# EAGLE design spi2par2019backpack (EAGLE 9.3.0)
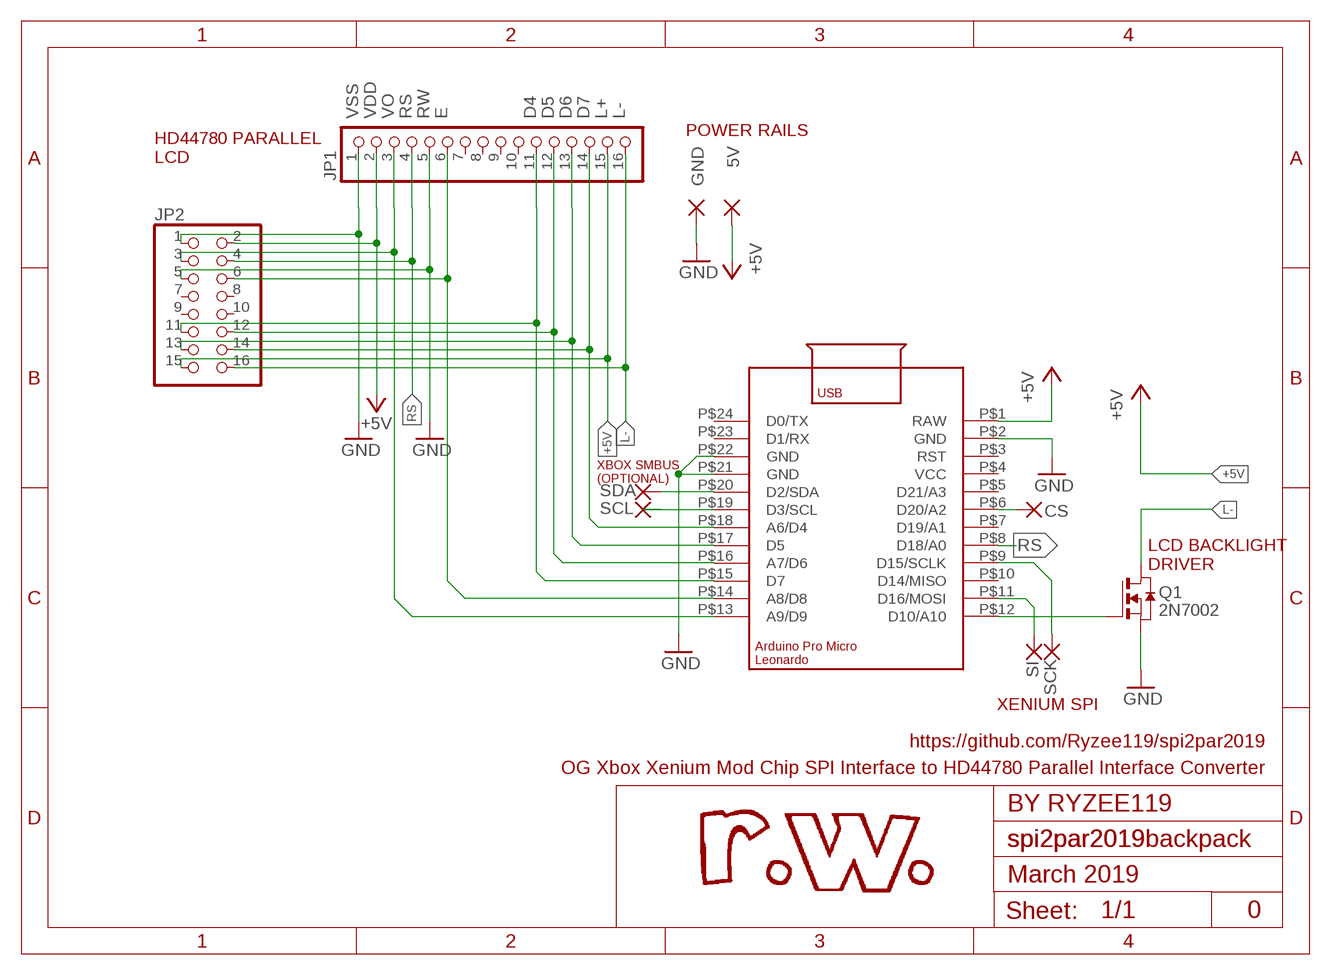
[diagram p0: schematic, sheet 1]

## Parts
5V  WIREPADSMD1,27-254  [SMD1,27-2,54]
CS  WIREPADSMD1,27-254  [SMD1,27-2,54]
GND  WIREPADSMD1,27-254  [SMD1,27-2,54]
JP1  PINHD-1X16  [1X16]
JP2  PINHD-2X8  [2X08]
Q1  2N70026Ω  NMOSSOT23  [SOT-23]
SCK  WIREPADSMD1,27-254  [SMD1,27-2,54]
SCL  WIREPADSMD1,27-254  [SMD1,27-2,54]
SDA  WIREPADSMD1,27-254  [SMD1,27-2,54]
SI  WIREPADSMD1,27-254  [SMD1,27-2,54]
U1  ARDUINO_LEONARDO_MICRO  [ARDUINO_LEONARDO_MICRO]

## Nets
+5V: 5V.1(P) JP1.2 JP1.15 JP2.2 JP2.15 U1.P$1(RAW)
D4: JP1.11 JP2.11 U1.P$15(D7)
D5: JP1.12 JP2.12 U1.P$16(A7/D6)
D6: JP1.13 JP2.13 U1.P$17(D5)
D7: JP1.14 JP2.14 U1.P$18(A6/D4)
E: JP1.6 JP2.6 U1.P$14(A8/D8)
GND: GND.1(P) JP1.1 JP1.5 JP2.1 JP2.5 Q1.2(S) U1.P$2(GND) U1.P$21(GND) U1.P$22(GND)
L-: JP1.16 JP2.16 Q1.1(D)
N$1: SCL.1(P) U1.P$19(D3/SCL)
N$2: CS.1(P) U1.P$6(D20/A2)
N$3: SCK.1(P) U1.P$9(D15/SCLK)
N$4: SI.1(P) U1.P$11(D16/MOSI)
N$11: Q1.3(G) U1.P$12(D10/A10)
N$14: SDA.1(P) U1.P$20(D2/SDA)
RS: JP1.4 JP2.4 U1.P$8(D18/A0)
VO: JP1.3 JP2.3 U1.P$13(A9/D9)
Unconnected: JP1.7 JP1.8 JP1.9 JP1.10 JP2.7 JP2.8 JP2.9 JP2.10 U1.P$3(RST) U1.P$4(VCC) U1.P$5(D21/A3) U1.P$7(D19/A1) U1.P$10(D14/MISO) U1.P$23(D1/RX) U1.P$24(D0/TX)

## Notes on the sheet
- VSS | VDD | VO | RS | RW | E | D4 | D5 | D6 | D7 | L+ | L-
- POWER RAILS
- HD44780 PARALLEL
  LCD
- XBOX SMBUS
  (OPTIONAL)
- LCD BACKLIGHT
  DRIVER
- 2N7002
- XENIUM SPI
- https://github.com/Ryzee119/spi2par2019
- OG Xbox Xenium Mod Chip SPI Interface to HD44780 Parallel Interface Converter
- BY RYZEE119
- spi2par2019
- March 2019
- 0

## Library data of the parts
5V CS GND SCK SCL SDA SI = wirepad:WIREPAD: Wire PAD connect wire on PCB
JP1 = pinhead:PINHD-1X16: PIN HEADER
JP2 = pinhead:PINHD-2X8: PIN HEADER
Q1 = zetex:NMOSSOT23: MOS FET; OC_FARNELL: unknown; OC_NEWARK: unknown
U1 = my-library:ARDUINO_LEONARDO_MICRO

## Board
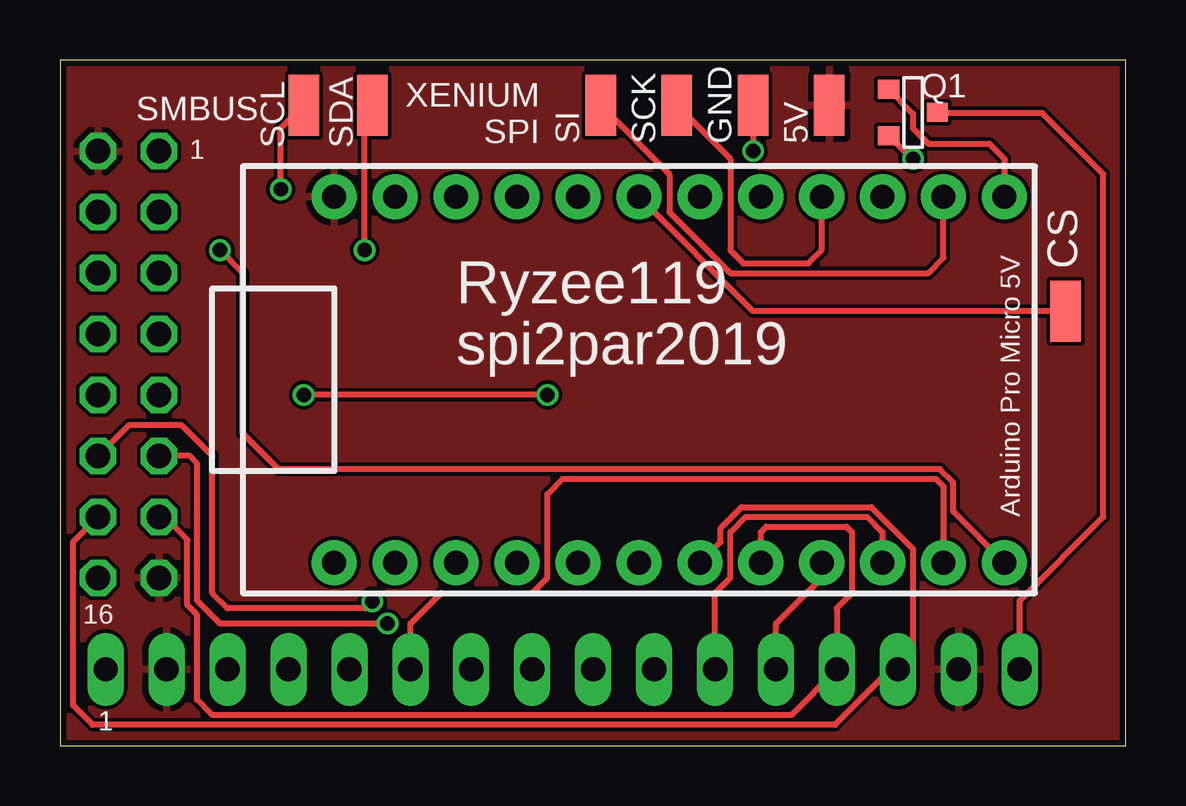
[diagram p1: board, top side]
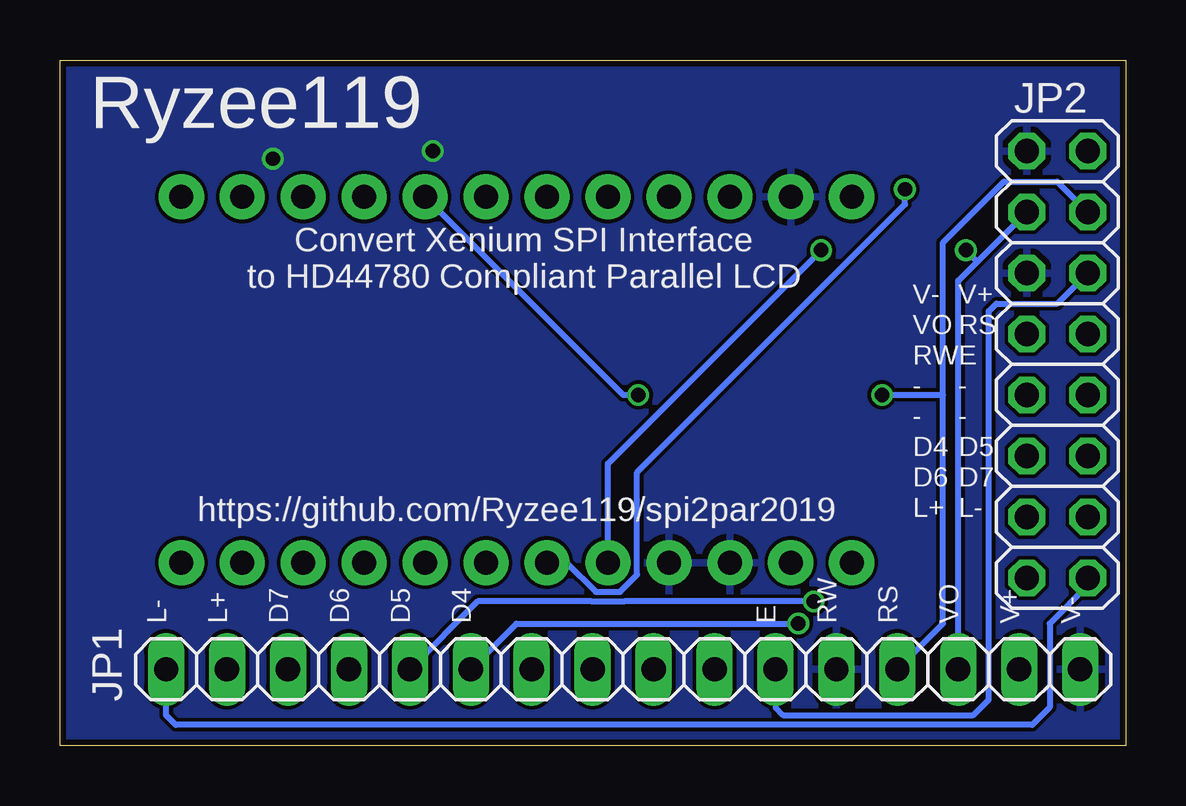
[diagram p2: board, bottom side, seen from below]

Size 44.43 x 28.56 mm. Coordinates in mm from the lower left corner, seen from the top.
Outline: 0,0 44.43,0 44.43,28.56 0,28.56 0,0
Copper layers (1*16): Top 0.035mm / dielectric 1.5mm / Bottom 0.035mm
Design rules "Elecrow_2-layer_eagle_rule": minimum track width 6mil, minimum drill 12mil, track to track 6mil, track to pad 6mil, pad to pad 6mil, via to via 6mil, smd to smd 0mil, copper to edge 10mil, drill to drill 10mil, minimum pad ring 10mil, minimum via ring 6mil, stop-mask expansion 2mil, vias tented up to drill 100mil, thermal gap 10mil

### Footprints (pad centres in the part's own frame; a part is rotated, then mirrored left to right if it is on the bottom)
SMD1,27-2,54 = smd 1.27 x 2.54: 1 0,0
1X16 = drill 1.016 long: 1 -19.05,0; 2 -16.51,0; 3 -13.97,0; 4 -11.43,0; 5 -8.89,0; 6 -6.35,0; 7 -3.81,0; 8 -1.27,0; 9 1.27,0; 10 3.81,0; 11 6.35,0; 12 8.89,0; 13 11.43,0; 14 13.97,0; 15 16.51,0; 16 19.05,0
2X08 = drill 1.016 octagon: 1 -8.89,-1.27; 2 -8.89,1.27; 3 -6.35,-1.27; 4 -6.35,1.27; 5 -3.81,-1.27; 6 -3.81,1.27; 7 -1.27,-1.27; 8 -1.27,1.27; 9 1.27,-1.27; 10 1.27,1.27; 11 3.81,-1.27; 12 3.81,1.27; 13 6.35,-1.27; 14 6.35,1.27; 15 8.89,-1.27; 16 8.89,1.27
SOT-23 = smd 0.787 x 0.889: 1 0.025,-1.016; 2 -0.94,1.016; 3 0.991,1.016
ARDUINO_LEONARDO_MICRO = drill 1 pad 1.88: P$1 16.51,29.21; P$2 16.51,26.67; P$3 16.51,24.13; P$4 16.51,21.59; P$5 16.51,19.05; P$6 16.51,16.51; P$7 16.51,13.97; P$8 16.51,11.43; P$9 16.51,8.89; P$10 16.51,6.35; P$11 16.51,3.81; P$12 16.51,1.27; P$13 1.27,1.27; P$14 1.27,3.81; P$15 1.27,6.35; P$16 1.27,8.89; P$17 1.27,11.43; P$18 1.27,13.97; P$19 1.27,16.51; P$20 1.27,19.05; P$21 1.27,21.59; P$22 1.27,24.13; P$23 1.27,26.67; P$24 1.27,29.21

### Placement (x,y rotation side)
5V  32.07,26.67 180 top
CS  41.91,18.1 0 top
GND  28.89,26.67 180 top
JP1  20.95,3.17 180 bottom
JP2  2.86,15.88 270 bottom
Q1  35.56,26.35 90 top
SCK  25.72,26.67 180 top
SCL  10.16,26.67 0 top
SDA  13.02,26.67 0 top
SI  22.54,26.67 180 top
U1  40.64,6.35 90 top

### Tracks (layer width: path | path; a pad name or v marks a point on that pad's centre or on a via)
+5V
  pour Top: -2.54,1.91 -2.54,32.38 45.72,32.38 45.72,-4.45 -2.54,-4.45
D4  (via drill 0.6)
  Top 0.254: v13.65,5.08 6.67,5.08 5.71,6.03 5.71,11.75 5.4,12.06 JP2.11 | U1.P$15 34.29,8.89 33.66,9.53 28.57,9.53 27.94,8.89 27.94,6.98 27.3,6.35 JP1.11
  Bottom 0.254: JP1.11 25.4,5.08 v13.65,5.08
D5  (via drill 0.6)
  Top 0.254: v13.02,6 12.73,5.71 6.99,5.71 6.35,6.35 6.35,12.06 5.08,13.33 2.86,13.33 JP2.12 | JP1.12 29.84,5.08 31.75,6.98 U1.P$16
  Bottom 0.254: JP1.12 27.02,6 22.27,6 22.26,5.99 20.92,5.99 20.91,6 v13.02,6
D6
  Top 0.254: JP2.13 4.36,9.53 5.31,8.57 5.31,5.86 5.71,5.46 5.71,1.91 6.35,1.27 30.48,1.27 JP1.13 32.38,5.71 33.02,6.35 33.02,8.89 32.79,9.12 29.44,9.12 29.21,8.89 U1.P$17
D7
  Top 0.254: JP2.14 0.55,8.48 0.55,1.68 1.36,0.86 32.31,0.86 34.62,3.17 JP1.14 35.56,3.81 35.56,8.2 33.82,9.93 28.41,9.93 27.53,9.06 27.53,8.48 U1.P$18
E
  Top 0.254: JP1.6 14.61,5.08 15.88,6.35 19.68,6.35 20.32,6.98 20.32,10.48 20.95,11.11 36.51,11.11 36.83,10.79 U1.P$14
  Bottom 0.254: JP1.6 14.61,1.59 14.29,1.27 6.35,1.27 5.71,1.91 5.71,18.1 5.4,18.42 2.86,18.42 JP2.6
GND  (via drill 0.6)
  Top 0.254: Q1.2 35.51,24.45 v35.56,24.45 | GND.1 v28.89,24.77
  pour Bottom: -3.81,8.26 -3.81,33.66 46.99,33.66 46.99,-5.71 -3.81,-5.71
L-
  Top 0.254: JP1.16 40.01,6.03 43.5,9.53 43.5,23.81 40.96,26.35 36.6,26.35 Q1.1
  Bottom 0.254: JP2.16 1.59,6.67 3.17,5.08 3.17,1.59 3.9,0.86 39.6,0.86 40.01,1.27 JP1.16
N$1  (via drill 0.6)
  Top 0.254: v9.21,23.18 9.21,25.72 SCL.1
  Bottom 0.254: v9.21,23.18 9.21,22.54 20.37,11.38 20.37,7.12 21.09,6.4 22.09,6.4 23.31,7.62 U1.P$19
N$2
  Top 0.254: CS.1 28.89,18.1 U1.P$6
N$3
  Top 0.254: SCK.1 27.94,24.45 27.94,20.64 28.49,20.09 31.2,20.09 31.75,20.64 U1.P$9
N$4
  Top 0.254: SI.1 25.4,23.81 25.4,22.23 27.94,19.69 36.2,19.69 36.83,20.32 U1.P$11
N$11
  Top 0.254: Q1.3 35.56,26.33 35.56,25.72 36.2,25.08 38.73,25.08 39.37,24.45 U1.P$12
N$14  (via drill 0.6)
  Top 0.254: v12.7,20.64 12.7,26.35 SDA.1
  Bottom 0.254: U1.P$20 21.59,11.75 v12.7,20.64
RS  (via drill 0.6)
  Top 0.254: v20.32,14.61 v10.16,14.61
  Bottom 0.254: JP2.4 2.86,23.5 5.08,23.5 7.62,20.96 7.62,14.61 | JP1.4 7.62,5.08 7.62,14.61 | U1.P$8 20.95,14.61 v20.32,14.61 | v10.16,14.61 7.62,14.61
VO  (via drill 0.6)
  Top 0.254: U1.P$13 37.24,9.75 37.24,10.96 36.68,11.52 25.4,11.52 9.12,11.52 7.62,13.02 7.62,19.69 v6.67,20.64
  Bottom 0.254: JP1.3 6.99,19.37 6.19,20.16 | 6.19,20.16 JP2.3 | v6.67,20.64 6.19,20.16

### Text on the board
tPlace: SMBUS | 1 | XENIUM / SPI | Ryzee119 | spi2par2019 | 16 | 1
bPlace: Ryzee119 | Convert Xenium SPI Interface / to HD44780 Compliant Parallel LCD | V+ | V- | RS | VO | E | RW | - | - | - | - | D5 | D4 | D7 | D6 | L- | L+ | https://github.com/Ryzee119/spi2par2019 | V- | V+ | VO | RS | RW | E | D4 | D5 | D6 | D7 | L+ | L-